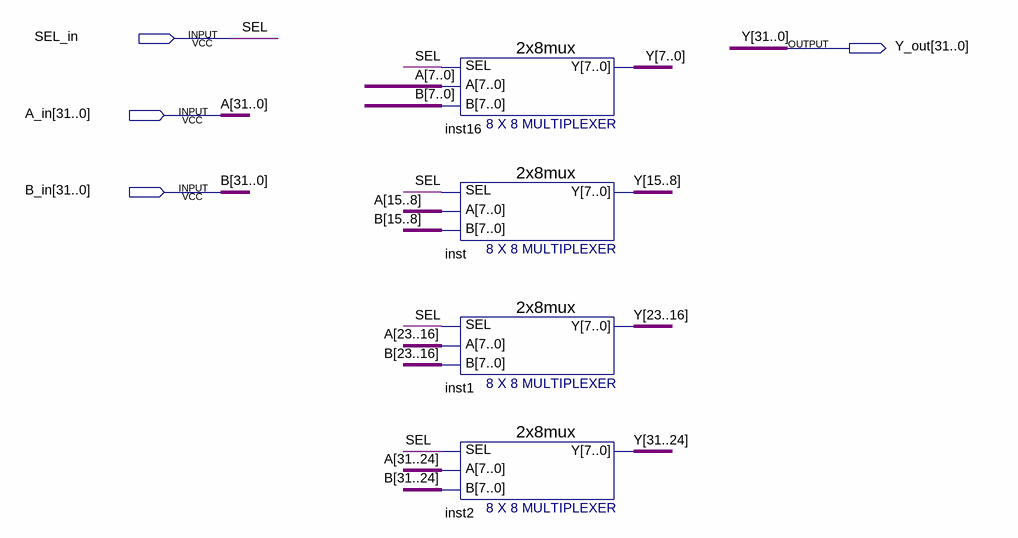
[diagram p0: schematic sheet]
// Quartus schematic 2x32Mux.bdf as structural Verilog: 4 symbols, 4 pins
module \2x32Mux  (
  input  SEL_in,
  input  [31:0] A_in,
  input  [31:0] B_in,
  output [31:0] Y_out
);

  \2x8mux  inst16 (.SEL(SEL_in), .A(A_in[7:0]), .B(B_in[7:0]), .Y(Y_out[7:0]));
  \2x8mux  inst (.SEL(SEL_in), .A(A_in[15:8]), .B(B_in[15:8]), .Y(Y_out[15:8]));
  \2x8mux  inst1 (.SEL(SEL_in), .A(A_in[23:16]), .B(B_in[23:16]), .Y(Y_out[23:16]));
  \2x8mux  inst2 (.SEL(SEL_in), .A(A_in[31:24]), .B(B_in[31:24]), .Y(Y_out[31:24]));

  // Other names for the same wires on the sheet: A[31:0] = A_in; B[31:0] = B_in; SEL = SEL_in; Y[31:0] = Y_out
endmodule
